# EAGLE design ESP_LoRa_1.1 (EAGLE 9.6.2)
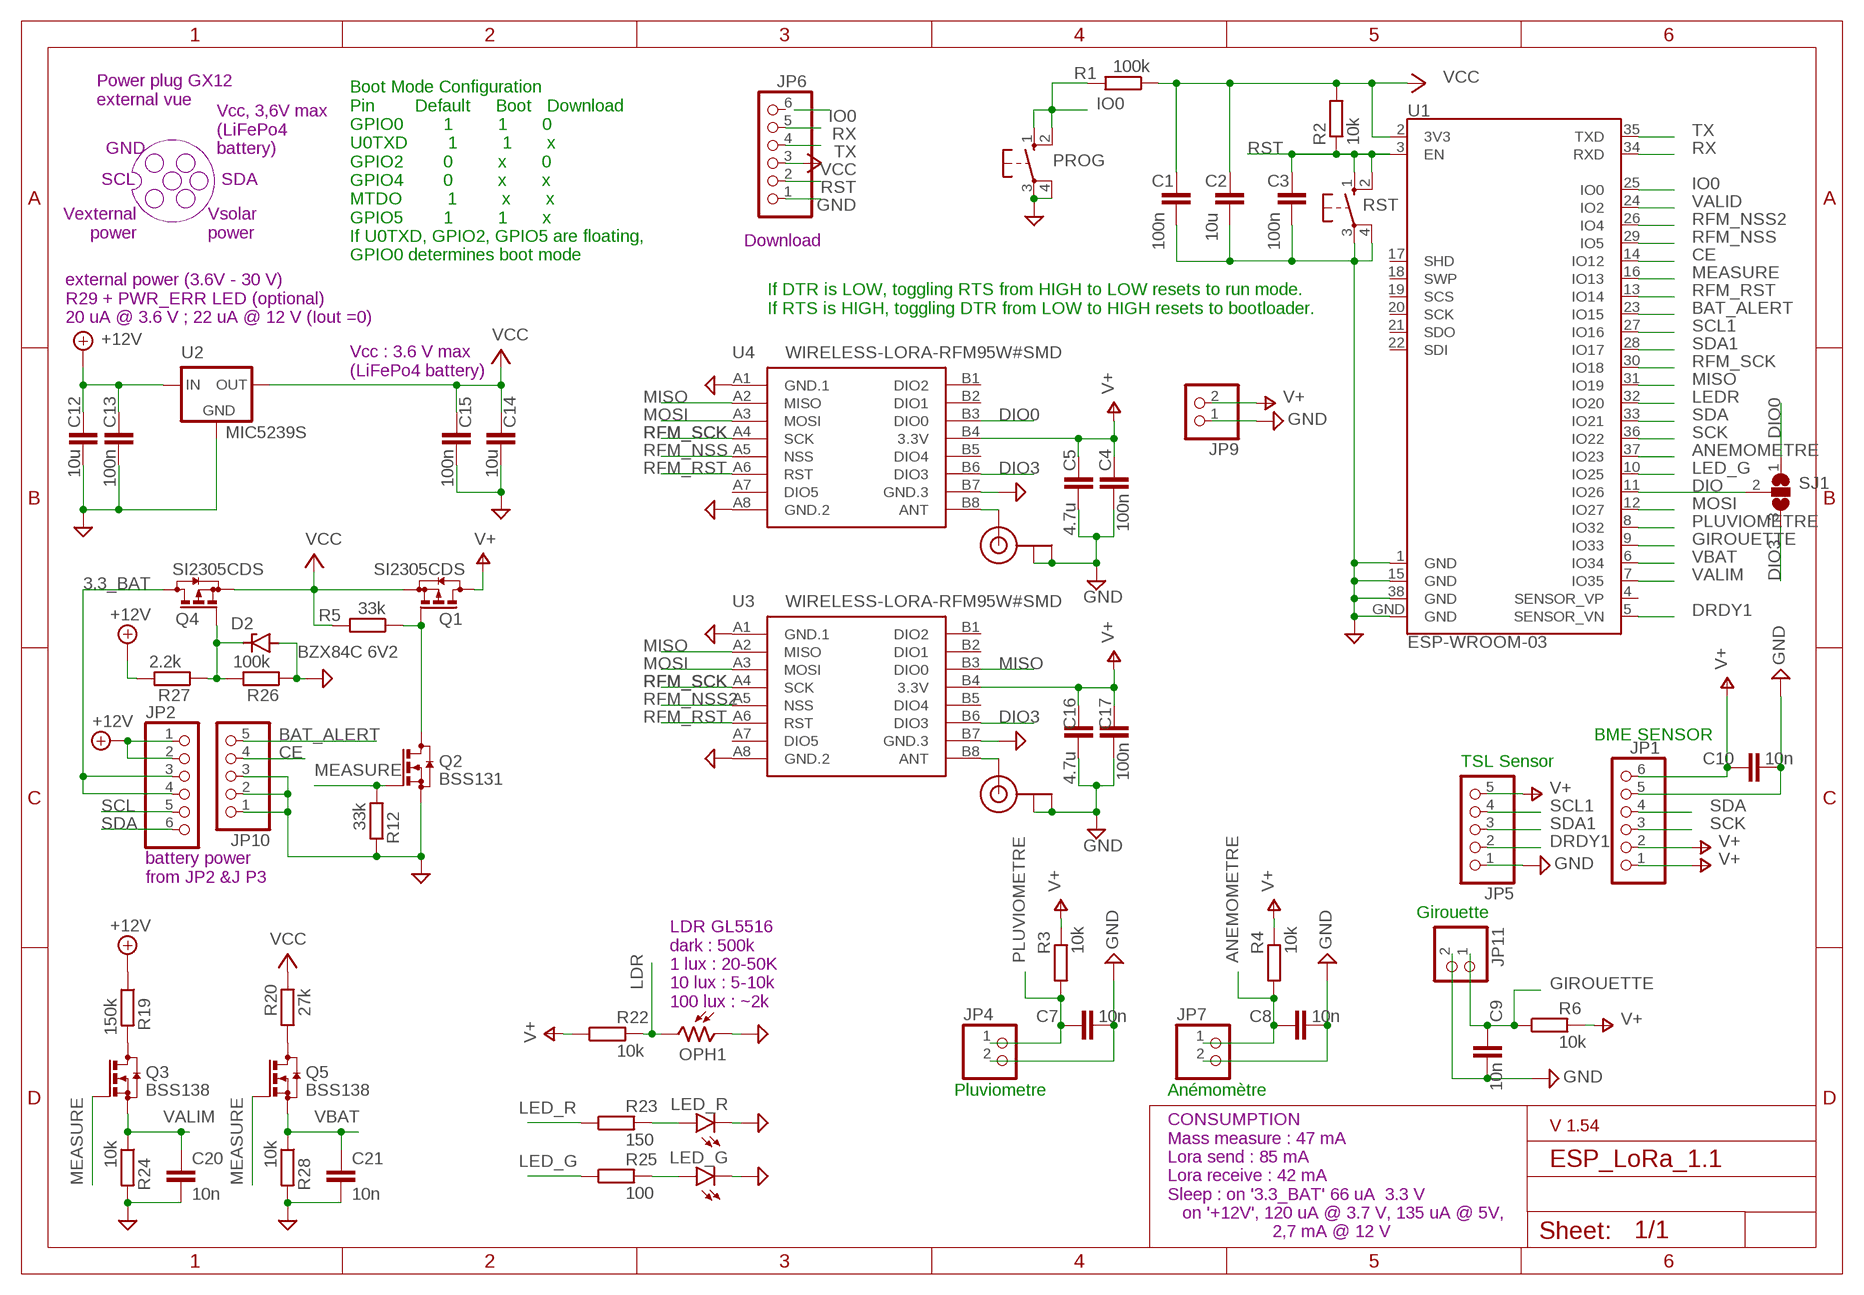
[diagram p0: schematic, sheet 1]

## Parts
C1  100n  CC1206  [C1206]
C2  10u  CC1210  [C1210]
C3  100n  CC1206  [C1206]
C4  100n  CC1206  [C1206]
C5  4.7u  CC1210  [C1210]
C7  10n  CC1206  [C1206]
C8  10n  CC1206  [C1206]
C9  10n  CC1206  [C1206]
C10  10n  CC1206  [C1206]
C12  10u  CC1210  [C1210]
C13  100n  CC1206  [C1206]
C14  10u  CC1210  [C1210]
C15  100n  CC1206  [C1206]
C16  4.7u  CC1210  [C1210]
C17  100n  CC1206  [C1206]
C20  10n  CC1206  [C1206]
C21  10n  CC1206  [C1206]
D2  BZX84C 6V2  BZX84CSMD  [TO236]
J1  U.FL  [U.FL]
J2  U.FL  [U.FL]
JP1  PINHD-1X6  [1X06]
JP2  PINHD-1X6  [1X06]
JP4  PINHD-1X2  [1X02]
JP5  PINHD-1X5  [1X05]
JP6  PINHD-1X6  [1X06]
JP7  PINHD-1X2  [1X02]
JP9  PINHD-1X2  [1X02]
JP10  PINHD-1X5  [1X05]
JP11  PINHD-1X2  [1X02]
LED_G  LEDSMT1206  [1206]
LED_R  LEDSMT1206  [1206]
OPH1  VT93N2  [VT900]
PROG  10-XX  [B3F-10XX]
Q1  SI2305CDS  [SOT23]
Q2  BSS131  [SOT23]
Q3  BSS138  [SOT23]
Q4  SI2305CDS  [SOT23]
Q5  BSS138  [SOT23]
R1  100k  RR1206  [R1206]
R2  10k  RR1206  [R1206]
R3  10k  RR1206  [R1206]
R4  10k  RR1206  [R1206]
R5  33k  RR1206  [R1206]
R6  10k  RR1206  [R1206]
R12  33k  RR1206  [R1206]
R19  150k  RR1206  [R1206]
R20  27k  RR1206  [R1206]
R22  10k  RR1206  [R1206]
R23  150  RR1206  [R1206]
R24  10k  RR1206  [R1206]
R25  100  RR1206  [R1206]
R26  100k  RR1206  [R1206]
R27  2.2k  RR1206  [R1206]
R28  10k  RR1206  [R1206]
RST  10-XX  [B3F-10XX]
SJ1  SJ2W  [SJ_2]
U1  ESP-WROOM-03  [ESP-WROOM-03]
U2  MIC5239S  [SOT223]
U3  WIRELESS-LORA-RFM95W#SMD  [WIRELESS-LORA-RFM95W#SMD]
U4  WIRELESS-LORA-RFM95W#SMD  [WIRELESS-LORA-RFM95W#SMD]

## Nets
3.3_BAT: JP2.3 JP2.4 Q4.3(D)
+12V: C12.1 C13.1 JP2.1 JP2.2 R19.1 R27.2 U2.1(IN)
ANEMOMETRE: C8.1 JP7.1 R4.1 U1.37(IO23)
ANT2: J2.3(SIGNAL) U4.B8(ANT)
ANT3: J1.3(SIGNAL) U3.B8(ANT)
BAT_ALERT: JP10.5 U1.23(IO15)
CE: JP10.4 U1.14(IO12)
DIO: SJ1.2 U1.11(IO26)
DIO0: SJ1.1 U4.B3(DIO0)
DIO3: SJ1.3 U3.B6(DIO3) U4.B6(DIO3)
DRDY1: JP5.2 U1.5(SENSOR_VN)
GIROUETTE: C9.1 JP11.1 R6.1 U1.9(IO33)
GND: C1.2 C2.2 C3.2 C4.2 C5.2 C7.2 C8.2 C9.2 C10.2 C12.2 C13.2 C14.2 C15.2 C16.2 C17.2 C20.2 C21.2 D2.A J1.1(GND) J1.2(GND) J2.1(GND) J2.2(GND) JP1.5 JP4.2 JP5.1 JP6.1 JP7.2 JP9.1 JP10.1 JP10.2 JP10.3 JP11.2 LED_G.C LED_R.C OPH1.1 PROG.3(P) PROG.4(P1) Q2.2(S) R12.2 R24.2 R26.1 R28.2 RST.3(P) RST.4(P1) U1.1(GND) U1.15(GND) U1.38(GND) U1.GND U2.2(GND) U2.4(GND) U3.A1(GND.1) U3.A8(GND.2) U3.B7(GND.3) U4.A1(GND.1) U4.A8(GND.2) U4.B7(GND.3)
IO0: PROG.1(S) PROG.2(S1) R1.2 U1.25(IO0)
LDR: OPH1.2 R22.2
LED_G: R25.1 U1.10(IO25)
LED_R: R23.1
LEDR: U1.32(IO20)
MEASURE: Q2.1(G) Q3.1(G) Q5.1(G) R12.1 U1.16(IO13)
MISO: U1.31(IO19) U3.A2(MISO) U3.B3(DIO0) U4.A2(MISO)
MOSI: U1.12(IO27) U3.A3(MOSI) U4.A3(MOSI)
N$1: Q1.1(G) Q2.3(D) R5.1
N$2: Q3.3(D) R19.2
N$5: Q5.3(D) R20.1
N$7: LED_R.A R23.2
N$8: LED_G.A R25.2
N$35: D2.C Q4.1(G) R26.2 R27.1
PLUVIOMETRE: C7.1 JP4.1 R3.1 U1.8(IO32)
RFM_NSS: U1.29(IO5) U4.A5(NSS)
RFM_NSS2: U1.26(IO4) U3.A5(NSS)
RFM_RST: U1.13(IO14) U3.A6(RST) U4.A6(RST)
RFM_SCK: U1.30(IO18) U3.A4(SCK) U4.A4(SCK)
RST: C3.1 JP6.2 R2.1 RST.1(S) RST.2(S1) U1.3(EN)
RX: JP6.5 U1.34(RXD)
SCK: JP1.3 U1.36(IO22)
SCL: JP2.5
SCL1: JP5.4 U1.27(IO16)
SDA: JP1.4 JP2.6 U1.33(IO21)
SDA1: JP5.3 U1.28(IO17)
TX: JP6.4 U1.35(TXD)
V+: C4.1 C5.1 C10.1 C16.1 C17.1 JP1.1 JP1.2 JP1.6 JP5.5 JP9.2 Q1.3(D) R3.2 R4.2 R6.2 R22.1 U3.B4(3.3V) U4.B4(3.3V)
VALID: U1.24(IO2)
VALIM: C20.1 Q3.2(S) R24.1 U1.7(IO35)
VBAT: C21.1 Q5.2(S) R28.1 U1.6(IO34)
VCC: C1.1 C2.1 C14.1 C15.1 JP6.3 Q1.2(S) Q4.2(S) R1.1 R2.2 R5.2 R20.2 U1.2(3V3) U2.3(OUT)
Unconnected: JP6.6 U1.4(SENSOR_VP) U1.17(SHD) U1.18(SWP) U1.19(SCS) U1.20(SCK) U1.21(SDO) U1.22(SDI) U3.A7(DIO5) U3.B1(DIO2) U3.B2(DIO1) U3.B5(DIO4) U4.A7(DIO5) U4.B1(DIO2) U4.B2(DIO1) U4.B5(DIO4)

## Notes on the sheet
- Power plug GX12
  external vue
- GND
- Vcc, 3,6V max
  (LiFePo4
  battery)
- SCL | SDA
- Download
- Vexternal
  power
- Vsolar 
  power
- Boot Mode Configuration
  Pin        Default     Boot   Download
  GPIO0        1         1       0
  U0TXD        1         1       x
  GPIO2        0         x       0
  GPIO4        0         x       x
  MTDO         1         x       x
  GPIO5        1         1       x
  If U0TXD, GPIO2, GPIO5 are floating, 
  GPIO0 determines boot mode
- If DTR is LOW, toggling RTS from HIGH to LOW resets to run mode.
  If RTS is HIGH, toggling DTR from LOW to HIGH resets to bootloader.
- external power (3.6V - 30 V)
  R29 + PWR_ERR LED (optional)
  20 uA @ 3.6 V ; 22 uA @ 12 V (Iout =0)
- Vcc : 3.6 V max 
  (LiFePo4 battery)
- BME SENSOR
- TSL Sensor
- battery power
  from JP2 &J P3
- Girouette
- LDR GL5516
  dark : 500k
  1 lux : 20-50K
  10 lux : 5-10k
  100 lux : ~2k
- Pluviometre | Anémomètre
- V 1.54
- CONSUMPTION
  Mass measure : 47 mA
  Lora send : 85 mA
  Lora receive : 42 mA
  Sleep : on '3.3_BAT' 66 uA  3.3 V
     on '+12V', 120 uA @ 3.7 V, 135 uA @ 5V,
                       2,7 mA @ 12 V

## Library data of the parts
C1-C5 C7-C10 C12-C17 C20 C21 = eagle-ltspice:C: CAPACITOR, European symbol; SPICEMODEL: NONE; SPICEPREFIX: C
D2 = diode:BZX84CSMD: Z DIODE
J1 J2 = microbuilder:U.FL: U.FL Antenna Connector
JP1 JP2 JP6 = pinhead:PINHD-1X6: PIN HEADER
JP4 JP7 JP9 JP11 = pinhead:PINHD-1X2: PIN HEADER
JP5 JP10 = pinhead:PINHD-1X5: PIN HEADER
LED_G LED_R = led:LED: LED OSRAM: - CHIPLED LG R971, LG N971, LY N971, LG Q971, LY Q971, LO R971, LY R971 LH N974, LH R974 LS Q976, LO Q976, LY Q976 LO Q996 - Hyper CHIPLED LW Q18S LB Q993, LB Q99A, LB R99A - SideLED LS A670, LO A670, LY A670, LG A670, LP A670 LB A673, LV A673, LT A673, LW A673 LH A674 LY A675 LS A676, LA A676, LO A676, LY A676, LW A676 LS A679, LY A679, LG A679 - Hyper Micro SIDELED® LS Y876, LA Y876, LO Y876, LY Y876 LT Y87S - SmartLED LW L88C, LW L88S LB L89C, LB L89S, LG L890 LS L89K, LO L89K, LY L89K LS L896, LA L896, LO L896, LY L896 - TOPLED LS T670, LO T670, LY T670, LG T670, LP T670 LSG T670, LSP T670, LSY T670, LOP T670, LYG T670 LG T671, LOG T671, LSG T671 LB T673, LV T673, LT T673, LW T673 LH T674 LS T676, LA T676, LO T676, LY T676, LB T676, LH T676, LSB T676, LW T676 LB T67C, LV T67C, LT T67C, LS T67K, LO T67K, LY T67K, LW E67C LS E67B, LA E67B, LO E67B, LY E67B, LB E67C, LV E67C, LT E67C LW T67C LS T679, LY T679, LG T679 LS T770, LO T770, LY T770, LG T770, LP T770 LB T773, LV T773, LT T773, LW T773 LH T774 LS E675, LA E675, LY E675, LS T675 LS T776, LA T776, LO T776, LY T776, LB T776 LHGB T686 LT T68C, LB T68C - Hyper Mini TOPLED® LB M676 - Mini TOPLED Santana® LG M470 LS M47K, LO M47K, LY M47K Source: http://www.osram.convergy.de LUXEON: - LUMILED® LXK2-PW12-R00, LXK2-PW12-S00, LXK2-PW14-U00, LXK2-PW14-V00 LXK2-PM12-R00, LXK2-PM12-S00, LXK2-PM14-U00 LXK2-PE12-Q00, LXK2-PE12-R00, LXK2-PE12-S00, LXK2-PE14-T00, LXK2-PE14-U00 LXK2-PB12-K00, LXK2-PB12-L00, LXK2-PB12-M00, LXK2-PB14-N00, LXK2-PB14-P00, LXK2-PB14-Q00 LXK2-PR12-L00, LXK2-PR12-M00, LXK2-PR14-Q00, LXK2-PR14-R00 LXK2-PD12-Q00, LXK2-PD12-R00, LXK2-PD12-S00 LXK2-PH12-R00, LXK2-PH12-S00 LXK2-PL12-P00, LXK2-PL12-Q00, LXK2-PL12-R00 Source: www.luxeon.com KINGBRIGHT: KA-3528ASYC Source: www.kingbright.com
OPH1 = photo-elements:VT9: Photoconductive Cell VT900 Series Source: http://optoelectronics.perkinelmer.com/content/Datasheets/DTS_vt900seriesdatasheet.pdf
PROG RST = switch-omron:10-XX: OMRON SWITCH; MPN: B3F-1000; OC_FARNELL: 176432; OC_NEWARK: 36M3542
Q1 Q4 = transistor-small-signal-perso:SI2305CDS: P-CHANNEL MOS FET
Q2 = transistor-small-signal-perso:BSS131: N-CHANNEL MOS FET
Q3 Q5 = detect:BSS138: N-CHANNEL MOS FET
R1-R6 R12 R19 R20 R22-R28 = eagle-ltspice:R: RESISTOR, European symbol; SPICEMODEL: NONE; SPICEPREFIX: R
SJ1 = jumper:SJ2W: SMD solder JUMPER
U1 = esp32-sparkfun (1):ESP-WROOM-03; OC_FARNELL: unknown
U2 = micrel:MIC5239S: LDO REGULATOR
U3 U4 = diy-modules:WIRELESS-LORA-RFM95W: 868/915 MHz LoRa Radio Transceiver Module based on SX1276 chip Click here to find device on ebay.com <http://www.ebay.com/sch/RFM95W+transceiver>

## Board
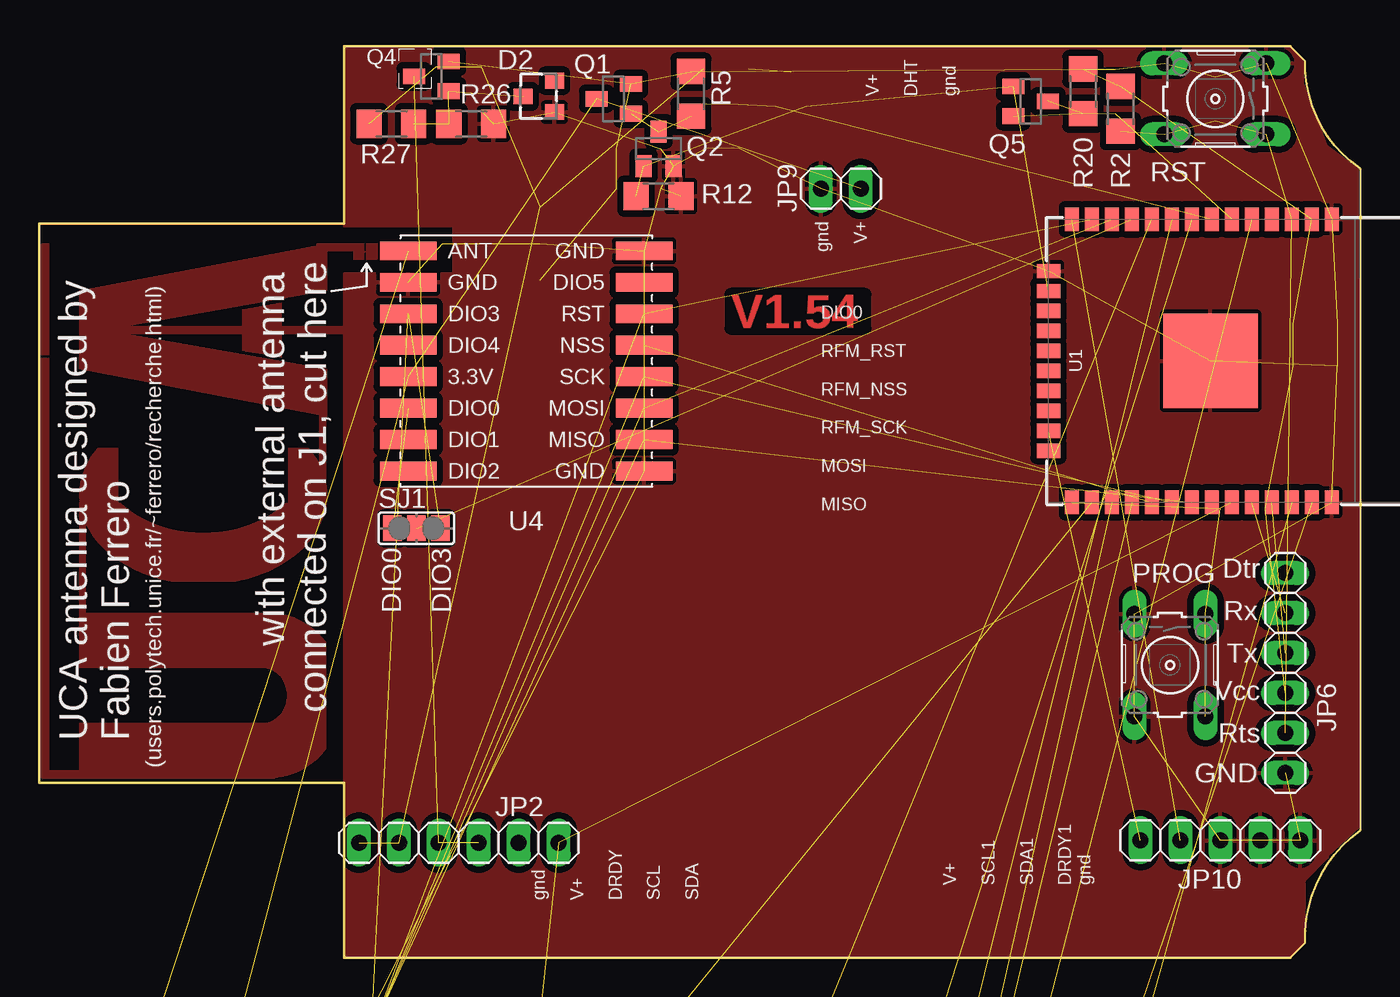
[diagram p1: board, top side]
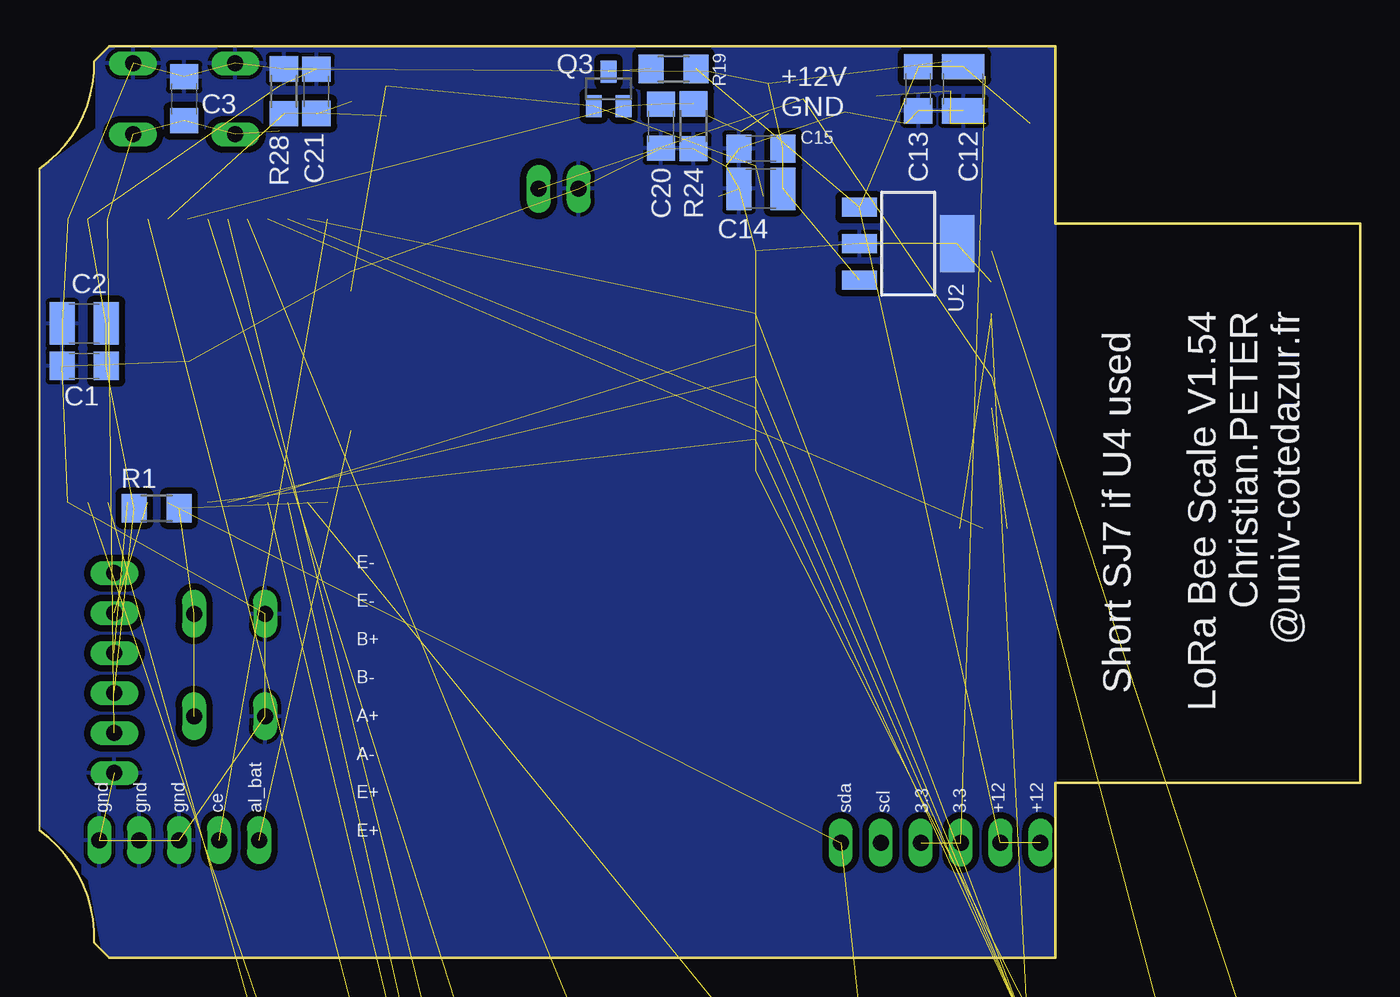
[diagram p2: board, bottom side, seen from below]

Size 83.98 x 57.94 mm. Coordinates in mm from the lower left corner, seen from the top.
Outline: 19.37,0 19.37,11.11 0,11.11 0,46.67 19.37,46.67 19.37,57.94 79.53,57.94 80.49,56.99 arc56 83.98,50.16 83.98,8.1 arc56 80.49,0.95 79.53,0 19.37,0
Copper layers (1*16): Top 0.035mm / dielectric 1.5mm / Bottom 0.035mm
Design rules "default *": minimum track width 6mil, minimum drill 0.35mm, track to track 6mil, track to pad 6mil, pad to pad 6mil, via to via 6mil, smd to smd 6mil, copper to edge 0mil, drill to drill 6mil, minimum pad ring 10mil, minimum via ring 8mil, stop-mask expansion 4mil, vias tented up to drill 0mil, thermal gap 10mil

### Footprints (pad centres in the part's own frame; a part is rotated, then mirrored left to right if it is on the bottom)
C1206 = smd 1.6 x 1.8: 1 -1.4,0; 2 1.4,0
C1210 = smd 1.6 x 2.7: 1 -1.4,0; 2 1.4,0
TO236 = smd 1 x 1.2: A -1,-1; C 0,1; NC 1,-1
U.FL = smd 2.2 x 1.05: 1 0,1.375; 2 0,-1.375 | smd 1.05 x 1: 3 1.525,0
1X06 = drill 1.016 long: 1 -6.35,0; 2 -3.81,0; 3 -1.27,0; 4 1.27,0; 5 3.81,0; 6 6.35,0
1X02 = drill 1.016 long: 1 -1.27,0; 2 1.27,0
1X05 = drill 1.016 long: 1 -5.08,0; 2 -2.54,0; 3 0,0; 4 2.54,0; 5 5.08,0
1206 = smd 1.6 x 1.803: A -1.422,0; C 1.422,0
VT900 = drill 0.8 pad 1.4: 1 -1.27,0; 2 1.27,0
B3F-10XX = drill 1.016 long: 1 -3.251,2.261; 2 3.251,2.261; 3 -3.251,-2.261; 4 3.251,-2.261
SOT23 = smd 1 x 1.4: 1 -0.95,-1.1; 2 0.95,-1.1; 3 0,1.1
R1206 = smd 1.6 x 1.803: 1 -1.422,0; 2 1.422,0
SJ_2 = smd 1.168 x 1.6: 1 -1.524,0; 2 0,0; 3 1.524,0
ESP-WROOM-03 = smd 0.9 x 1.5: 1 7.7,9; 2 6.43,9; 3 5.16,9; 4 3.89,9; 5 2.62,9; 6 1.35,9; 7 0.08,9; 8 -1.19,9; 9 -2.46,9; 10 -3.73,9; 11 -5,9; 12 -6.27,9; 13 -7.54,9; 14 -8.81,9; 25 -8.81,-9; 26 -7.54,-9; 27 -6.27,-9; 28 -5,-9; 29 -3.73,-9; 30 -2.46,-9; 31 -1.19,-9; 32 0.08,-9; 33 1.35,-9; 34 2.62,-9; 35 3.89,-9; 36 5.16,-9; 37 6.43,-9; 38 7.7,-9 | smd 1.5 x 0.9: 15 -10.3,5.715; 16 -10.3,4.445; 17 -10.3,3.175; 18 -10.3,1.905; 19 -10.3,0.635; 20 -10.3,-0.635; 21 -10.3,-1.905; 22 -10.3,-3.175; 23 -10.3,-4.445; 24 -10.3,-5.715 | smd 6 x 6: GND 0,0
SOT223 = smd 1.219 x 2.235: 1 -2.311,-3.099; 2 0,-3.099; 3 2.311,-3.099 | smd 3.6 x 2.2: 4 0,3.099
WIRELESS-LORA-RFM95W#SMD = smd 3.6 x 1.2: A1 -7.5,7; A2 -7.5,5; A3 -7.5,3; A4 -7.5,1; A5 -7.5,-1; A6 -7.5,-3; A7 -7.5,-5; A8 -7.5,-7; B1 7.5,7; B2 7.5,5; B3 7.5,3; B4 7.5,1; B5 7.5,-1; B6 7.5,-3; B7 7.5,-5; B8 7.5,-7

### Placement (x,y rotation side)
C1  81.12,37.62 180 bottom
C2  81.12,40.32 180 bottom
C3  74.77,54.61 90 bottom
C4  8.25,-26.04 0 top  (outside the outline)
C5  3.17,-26.67 0 top  (outside the outline)
C7  -0.79,-191.93 0 top  (outside the outline)
C8  -0.79,-215.27 0 top  (outside the outline)
C9  -0.79,-251.62 0 top  (outside the outline)
C10  -0.79,-269.56 0 top  (outside the outline)
C12  25.24,55.25 270 bottom
C13  28.1,55.25 270 bottom
C14  38.1,48.9 180 bottom
C15  38.1,51.44 180 bottom
C16  3.17,-62.55 0 top  (outside the outline)
C17  8.25,-61.91 0 top  (outside the outline)
C20  44.45,52.86 270 bottom
C21  66.36,55.09 90 bottom
D2  31.75,54.77 90 top
J1  -1.59,-62.71 0 top  (outside the outline)
J2  -1.59,-26.83 0 top  (outside the outline)
JP1  4.92,-241.3 0 top  (outside the outline)
JP2  26.67,7.3 0 top
JP4  -0.16,-198.75 0 top  (outside the outline)
JP5  3.65,-246.7 0 top  (outside the outline)
JP6  79.22,18.1 90 top
JP7  -0.16,-228.28 0 top  (outside the outline)
JP9  50.96,48.9 0 top
JP10  75.09,7.46 180 top
JP11  -0.16,-264.64 0 top  (outside the outline)
LED_G  -0.95,-124.62 0 top  (outside the outline)
LED_R  6.51,-124.62 0 top  (outside the outline)
OPH1  -0.32,-110.97 0 top  (outside the outline)
PROG  71.88,18.61 270 top
Q1  36.51,54.61 90 top
Q2  39.37,51.44 0 top
Q3  47.78,55.25 0 bottom
Q4  24.92,56.04 90 top
Q5  63.02,54.45 270 top
R1  76.52,28.58 0 bottom
R2  68.74,53.98 90 top
R3  -0.79,-209.07 0 top  (outside the outline)
R4  -0.79,-221.46 0 top  (outside the outline)
R5  41.43,54.93 90 top
R6  -0.79,-257.81 0 top  (outside the outline)
R12  39.37,48.42 0 top
R19  43.66,56.52 180 bottom
R20  66.36,55.09 90 top
R22  6.83,-109.7 0 top  (outside the outline)
R23  -0.79,-118.43 0 top  (outside the outline)
R24  42.39,52.86 270 bottom
R25  4.29,-118.43 0 top  (outside the outline)
R26  27.46,53.02 180 top
R27  22.38,53.02 180 top
R28  68.42,55.09 90 bottom
RST  74.77,54.61 180 top
SJ1  23.97,27.3 0 top
U1  74.46,37.95 0 top
U2  28.73,45.4 270 bottom
U3  11.27,-47.47 0 top  (outside the outline)
U4  30.96,37.94 180 top

### Tracks (layer width: path | path; a pad name or v marks a point on that pad's centre or on a via)
3.3_BAT  (2 unrouted)
+12V  (6 unrouted)
ANEMOMETRE  (3 unrouted)
ANT
  pour Top: 14.99,11.42 0.14,11.42 0.14,38.12 0.64,38.12 0.64,11.92 2.54,11.92 2.54,14.92 14.19,14.92 14.32,14.92 14.46,14.94 14.59,14.97 14.73,15.02 14.85,15.08 14.97,15.15 15.09,15.23 15.2,15.33 15.3,15.43 15.39,15.54 15.48,15.66 15.55,15.79 15.61,15.93 15.67,16.07 15.71,16.21 15.74,16.36 15.76,16.51 15.76,16.67 15.76,16.82 15.74,16.97 15.71,17.12 15.67,17.26 15.61,17.41 15.55,17.54 15.48,17.67 15.39,17.79 15.3,17.9 15.2,18 15.09,18.1 14.97,18.18 14.85,18.25 14.73,18.31 14.59,18.36 14.46,18.39 14.32,18.41 14.19,18.42 2.54,18.42 2.54,28.92 2.57,28.92 2.55,29.53 2.61,30.14 2.75,30.73 2.99,31.34 3.31,31.9 3.72,32.41 5.03,32.41 5.03,28.92 5.17,28.92 5.5,28.62 5.85,28.36 6.22,28.12 6.63,27.89 7.06,27.69 7.5,27.51 7.96,27.36 8.44,27.24 8.92,27.14 9.42,27.07 9.92,27.02 10.42,27.01 10.92,27.02 11.42,27.07 11.92,27.14 12.41,27.24 12.88,27.36 13.35,27.51 13.78,27.69 14.21,27.89 14.62,28.12 14.99,28.36 15.34,28.62 15.67,28.92 15.82,28.92 15.82,32.41 17.13,32.41 17.25,32.26 17.37,32.11 17.49,31.94 17.59,31.78 17.69,31.62 17.79,31.45 17.79,34.51 2.54,37.42 2.54,42.41 17.64,45.29 17.64,45.42 20.14,45.42 20.14,45.41 20.64,45.41 20.64,44.93 20.76,44.93 20.76,45.41 22.54,45.41 22.54,44.39 20.77,44.39 20.77,44.87 20.64,44.87 20.64,44.4 19.99,44.4 19.99,44.92 18.31,44.92 18.31,42.41 5.61,40.17 12.91,40.17 12.91,41.22 15.4,41.66 15.4,40.17 19.99,40.17 19.99,40.42 20.39,40.42 20.39,39.41 19.99,39.41 19.99,39.67 15.4,39.67 15.4,38.16 14.21,38.38 13.08,38.55 13.08,38.59 12.91,38.61 12.91,39.67 5.61,39.67 18.31,37.42 18.31,34.42 18.24,34.43 18.24,30.17 18.3,29.63 18.29,29.08 18.21,28.54 18.06,27.99 17.83,27.47 17.55,26.98 17.18,26.48 16.76,26.03 16.3,25.61 15.76,25.21 15.17,24.87 14.57,24.57 13.89,24.29 13.2,24.08 12.49,23.92 8.35,23.92 7.75,24.05 7.15,24.23 6.57,24.44 6.03,24.68 5.51,24.95 5.02,25.27 4.58,25.59 4.16,25.94 3.79,26.34 3.47,26.73 3.19,27.15 2.95,27.59 2.95,21.92 14.99,21.92 14.99,21.9 15.4,21.85 15.81,21.75 16.21,21.62 16.59,21.44 16.96,21.23 17.31,20.99 17.65,20.71 17.96,20.4 18.24,20.06 18.24,13.27 17.96,12.93 17.65,12.62 17.31,12.34 16.96,12.1 16.59,11.89 16.21,11.71 15.81,11.58 15.4,11.48 14.99,11.43
ANT1
  pour Top: 0.64,38.31 0.14,38.31 0.14,45.42 0.64,45.42
ANT2  (1 unrouted)
ANT3  (1 unrouted)
BAT_ALERT  (1 unrouted)
CE  (1 unrouted)
DIO  (1 unrouted)
DIO0  (1 unrouted)
DIO3  (2 unrouted)
DRDY1  (1 unrouted)
GIROUETTE  (3 unrouted)
GND  (55 unrouted)
  pour Top (isolate 0.406): 19.37,0 19.37,43.5 26.35,43.5 26.35,46.51 19.37,46.51 19.37,57.79 79.53,57.79 80.33,56.99 80.33,55.56 81.81,51.62 83.82,50.12 83.93,8.33 81.9,6.43 81.9,6.33 80.41,4.85 80.41,1.04 79.38,0
  pour Bottom (isolate 0.406): 19.37,0 19.37,57.79 79.53,57.79 80.33,56.99 80.33,52.72 83.82,50.13 83.93,8.45 81.21,5.89 81.21,5.32 80.79,4.91 79.98,0.61 79.38,0
IO0  (3 unrouted)
LDR  (1 unrouted)
LED_G  (1 unrouted)
MEASURE  (4 unrouted)
MISO  (3 unrouted)
MOSI  (2 unrouted)
N$1  (2 unrouted)
N$2  (1 unrouted)
N$5  (1 unrouted)
N$7  (1 unrouted)
N$8  (1 unrouted)
N$35  (3 unrouted)
PLUVIOMETRE  (3 unrouted)
RFM_NSS  (1 unrouted)
RFM_NSS2  (1 unrouted)
RFM_RST  (2 unrouted)
RFM_SCK  (2 unrouted)
RST  (5 unrouted)
RX  (1 unrouted)
SCK  (1 unrouted)
SCL1  (1 unrouted)
SDA  (2 unrouted)
SDA1  (1 unrouted)
TX  (1 unrouted)
V+  (16 unrouted)
VALIM  (3 unrouted)
VBAT  (3 unrouted)
VCC  (12 unrouted)

### Text on the board
Top: V1.54
tNames: V+ / / DHT / / gnd | gnd / / V+ | with external antenna / connected on J1, cut here | DIO0 / / RFM_RST / / RFM_NSS / / RFM_SCK / / MOSI / / MISO | Dtr | Rx | DIO0 | DIO3 | Tx | Vcc | UCA antenna designed by / Fabien Ferrero | Rts | (users.polytech.unice.fr/~ferrero/recherche.html) | GND | V+ / / SCL1 / / SDA1 / / DRDY1 / gnd | gnd / / V+ / / DRDY / / SCL / / SDA
bNames: +12V / GND | LoRa Bee Scale V1.54 / Christian.PETER / @univ-cotedazur.fr | Short SJ7 if U4 used | E- / / E- / / B+ / / B- / / A+ / / A- / / E+ / / E+ | sda / / scl / / 3.3 / / 3.3 / / +12 / / +12 | gnd / / gnd / / gnd / / ce / / al_bat